# Altium schematic sheet note_move_input.SchDoc
size A
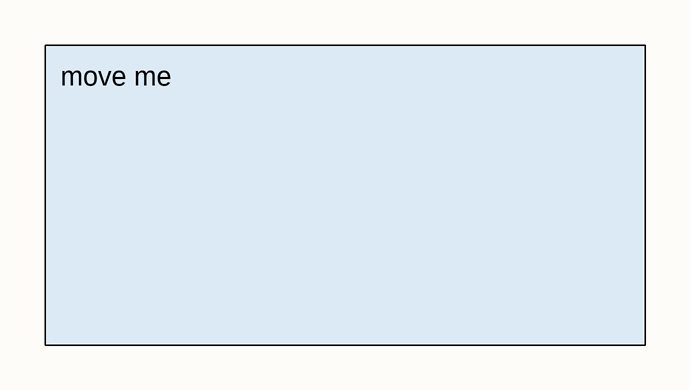
[diagram p0: note_move_input.SchDoc]

## Notes on the sheet
- move me